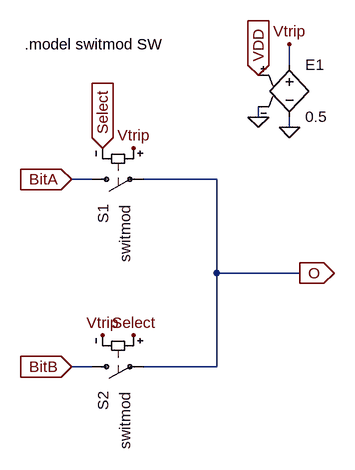
[diagram p0: schematic Selectorbit.asc]
Selectorbit.asc, the LTspice schematic file:
Version 4
SHEET 1 6308 700
WIRE 2240 -816 2240 -848
WIRE 2192 -736 2192 -752
WIRE 2240 -720 2240 -736
WIRE 1936 -640 1904 -640
WIRE 2128 -640 2016 -640
WIRE 2128 -496 2128 -640
WIRE 2256 -496 2128 -496
WIRE 1936 -352 1904 -352
WIRE 2128 -352 2128 -496
WIRE 2128 -352 2016 -352
FLAG 1904 -640 BitA
IOPIN 1904 -640 In
FLAG 2192 -800 VDD
IOPIN 2192 -800 In
FLAG 2240 -720 0
FLAG 2192 -736 0
FLAG 2240 -848 Vtrip
FLAG 2000 -688 Vtrip
FLAG 1952 -688 Select
IOPIN 1952 -688 In
FLAG 1952 -400 Vtrip
FLAG 2000 -400 Select
FLAG 1904 -352 BitB
IOPIN 1904 -352 In
FLAG 2256 -496 O
IOPIN 2256 -496 Out
SYMBOL e 2240 -832 R0
SYMATTR InstName E1
SYMATTR Value 0.5
SYMBOL sw 1920 -640 M90
WINDOW 3 24 -12 Left 0
WINDOW 38 39 67 Left 0
WINDOW 0 38 33 Left 0
SYMATTR Value ""
SYMATTR SpiceModel switmod
SYMATTR InstName S1
SYMBOL sw 1920 -352 M90
WINDOW 3 24 -12 Left 0
WINDOW 38 39 67 Left 0
WINDOW 0 38 33 Left 0
SYMATTR Value ""
SYMATTR SpiceModel switmod
SYMATTR InstName S2
TEXT 1832 -848 Left 0 !.model switmod SW

The netlist it stands for:
* Selectorbit.asc
E1 Vtrip 0 VDD 0 0.5
S1 BitA O Vtrip Select switmod
S2 BitB O Select Vtrip switmod
.model switmod SW
.backanno
.end